# Altium schematic sheet Relay_circuit.SchDoc
size A4; SheetNumber: 3; SheetTotal: 6
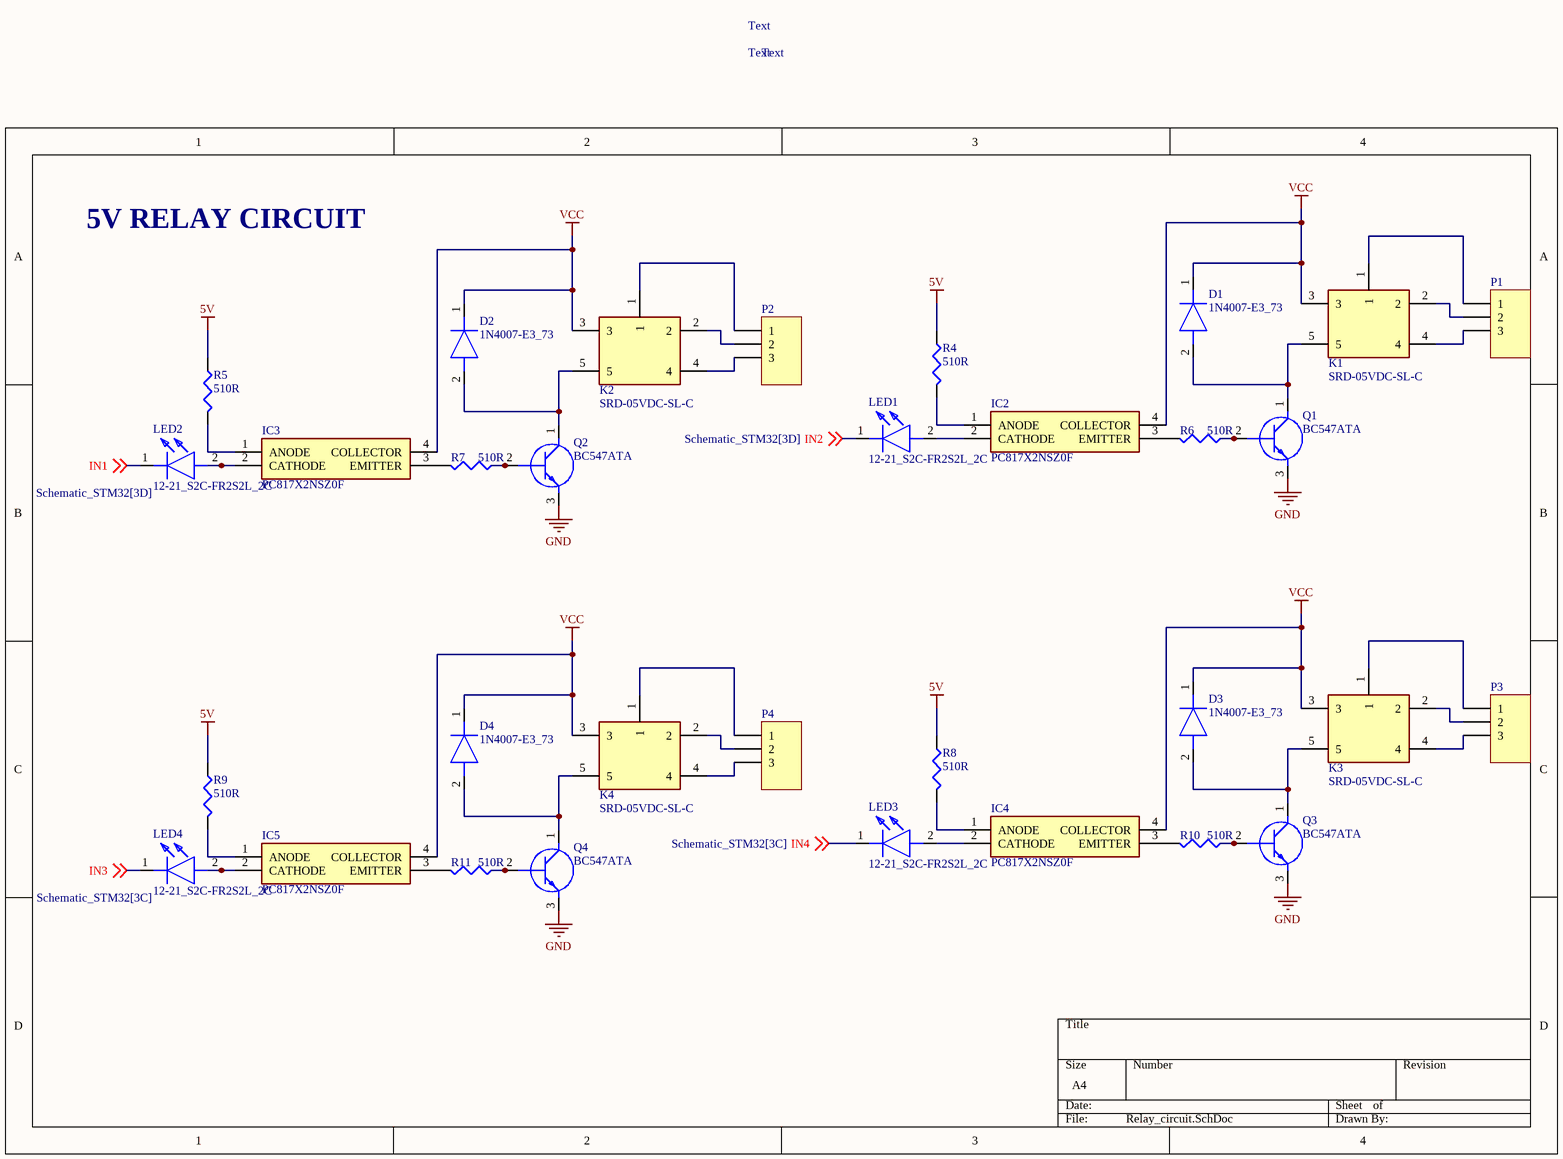
[diagram p0: Relay_circuit.SchDoc]

## Parts
D1  1N4007-E3_73  [DIOAD1405W86L465D235]
D2  1N4007-E3_73  [DIOAD1405W86L465D235]
D3  1N4007-E3_73  [DIOAD1405W86L465D235]
D4  1N4007-E3_73  [DIOAD1405W86L465D235]
IC2  PC817X2NSZ0F  [DIP762W60P254L458H400Q4N]
IC3  PC817X2NSZ0F  [DIP762W60P254L458H400Q4N]
IC4  PC817X2NSZ0F  [DIP762W60P254L458H400Q4N]
IC5  PC817X2NSZ0F  [DIP762W60P254L458H400Q4N]
K1  SRD-05VDC-SL-C  [SRD]
K2  SRD-05VDC-SL-C  [SRD]
K3  SRD-05VDC-SL-C  [SRD]
K4  SRD-05VDC-SL-C  [SRD]
LED1  12-21_S2C-FR2S2L_2C  [1221S2CFR2S2L2C]
LED2  12-21_S2C-FR2S2L_2C  [1221S2CFR2S2L2C]
LED3  12-21_S2C-FR2S2L_2C  [1221S2CFR2S2L2C]
LED4  12-21_S2C-FR2S2L_2C  [1221S2CFR2S2L2C]
P1  Header 3  [CON4PIN5MM]  (value not drawn)
P2  Header 3  [CON4PIN5MM]  (value not drawn)
P3  Header 3  [CON4PIN5MM]  (value not drawn)
P4  Header 3  [CON4PIN5MM]  (value not drawn)
Q1  BC547ATA  [TO-92_(TO-226)]
Q2  BC547ATA  [TO-92_(TO-226)]
Q3  BC547ATA  [TO-92_(TO-226)]
Q4  BC547ATA  [TO-92_(TO-226)]
R4  value 510R  [J1-0603]  (hidden comment: Res3)
R5  value 510R  [J1-0603]  (hidden comment: Res3)
R6  value 510R  [J1-0603]  (hidden comment: Res3)
R7  value 510R  [J1-0603]  (hidden comment: Res3)
R8  value 510R  [J1-0603]  (hidden comment: Res3)
R9  value 510R  [J1-0603]  (hidden comment: Res3)
R10  value 510R  [J1-0603]  (hidden comment: Res3)
R11  value 510R  [J1-0603]  (hidden comment: Res3)

## Nets
5V: R4.1 R5.1 R8.1 R9.1
GND: Q1.3(E) Q2.3(E) Q3.3(E) Q4.3(E)
VCC: D1.1(K) D2.1(K) D3.1(K) D4.1(K) IC2.4(COLLECTOR) IC3.4(COLLECTOR) IC4.4(COLLECTOR) IC5.4(COLLECTOR) K1.3 K2.3 K3.3 K4.3
IN1: LED2.1(K) ; off-sheet IN1
IN2: LED1.1(K) ; off-sheet IN2
IN3: LED4.1(K) ; off-sheet IN3
IN4: LED3.1(K) ; off-sheet IN4
NetD1_2: D1.2(A) K1.5 Q1.1(C)
NetD2_2: D2.2(A) K2.5 Q2.1(C)
NetD3_2: D3.2(A) K3.5 Q3.1(C)
NetD4_2: D4.2(A) K4.5 Q4.1(C)
NetIC2_1: IC2.1(ANODE) R4.2
NetIC2_2: IC2.2(CATHODE) LED1.2(A)
NetIC2_3: IC2.3(EMITTER) R6.2
NetIC3_1: IC3.1(ANODE) R5.2
NetIC3_2: IC3.2(CATHODE) LED2.2(A)
NetIC3_3: IC3.3(EMITTER) R7.2
NetIC4_1: IC4.1(ANODE) R8.2
NetIC4_2: IC4.2(CATHODE) LED3.2(A)
NetIC4_3: IC4.3(EMITTER) R10.2
NetIC5_1: IC5.1(ANODE) R9.2
NetIC5_2: IC5.2(CATHODE) LED4.2(A)
NetIC5_3: IC5.3(EMITTER) R11.2
NetK1_1: K1.1 P1.1
NetK1_2: K1.2 P1.2
NetK1_4: K1.4 P1.3
NetK2_1: K2.1 P2.1
NetK2_2: K2.2 P2.2
NetK2_4: K2.4 P2.3
NetK3_1: K3.1 P3.1
NetK3_2: K3.2 P3.2
NetK3_4: K3.4 P3.3
NetK4_1: K4.1 P4.1
NetK4_2: K4.2 P4.2
NetK4_4: K4.4 P4.3
NetQ1_2: Q1.2(B) R6.1
NetQ2_2: Q2.2(B) R7.1
NetQ3_2: Q3.2(B) R10.1
NetQ4_2: Q4.2(B) R11.1

Not connected (* = marked no-connect by the designer): P1 4; P2 4; P3 4; P4 4

## Notes on the sheet
- Text
- 5V RELAY CIRCUIT

## Library data of the parts
D1-D4 = 1N4007-E3_73: Diode; Manufacturer_Name: Vishay; Manufacturer_Part_Number: 1N4007-E3/73; Datasheet Link: https://mouser.componentsearchengine.com/Datasheets/2/1N4007-E3_73.pdf; Mouser Part Number: 625-1N4007-E3/73; Mouser Price/Stock: https://www.mouser.co.uk/ProductDetail/Vishay-General-Semiconductor/1N4007-E3-73?qs=N4vtoAxH%2FSqT3Ng3e4K0Gw%3D%3D; Arrow Part Number: 1N4007-E3/73; Arrow Price/Stock: https://www.arrow.com/en/products/1n4007-e373/vishay?region=europe
IC2-IC5 = PC817X2NSZ0F: Integrated Circuit; Manufacturer_Name: Sharp Microelectronics; Datasheet Link: https://datasheet.datasheetarchive.com/originals/distributors/Datasheets_SAMA/458e45842a103a05998fcebbd6f7366e.pdf; Height: 4mm; Manufacturer_Part_Number: PC817X2NSZ0F; Mouser Part Number: N/A; Mouser Price/Stock: https://www.mouser.co.uk/ProductDetail/Sharp-Microelectronics/PC817X2NSZ0F?qs=6kT3pPPHxnU7uYWM8Yy85A%3D%3D
K1-K4 = SRD-05VDC-SL-C: Relay or Contactor; Manufacturer_Name: Songle Relay; Datasheet Link: http://files.microjpm.webnode.com/200001010-dda41de9e1/Songle%20Relay%20Datasheet.pdf; Manufacturer_Part_Number: SRD-05VDC-SL-C
LED1-LED4 = 12-21_S2C-FR2S2L_2C: LED; Manufacturer_Name: Everlight; Manufacturer_Part_Number: 12-21/S2C-FR2S2L/2C; Datasheet Link: https://datasheet.lcsc.com/szlcsc/1901141904_Everlight-Elec-12-21-S2C-FR2S2L-2C_C183856.pdf; Height: 2.2mm
P1-P4 = Header 4: Header, 4-Pin; LatestRevisionDate: 17-Jul-2002; LatestRevisionNote: Re-released for DXP Platform.; Publisher: Altium Limited
Q1-Q4 = BC547ATA: Transistor BJT NPN; Manufacturer_Name: onsemi; Datasheet Link: https://www.onsemi.com/pub/Collateral/BC550-D.pdf; Manufacturer_Part_Number: BC547ATA; Mouser Part Number: 512-BC547ATA; Mouser Price/Stock: https://www.mouser.co.uk/ProductDetail/onsemi-Fairchild/BC547ATA?qs=ljbEvF4DwOMRdLfuzO8N4w%3D%3D; Arrow Part Number: BC547ATA; Arrow Price/Stock: https://www.arrow.com/en/products/bc547ata/on-semiconductor?region=europe
R4-R11 = Res3: Resistor; Published: 8-Jun-2000; LatestRevisionDate: 29-May-2009; LatestRevisionNote: IPC-7351 Footprint Added.; PackageReference: J1-0603; Publisher: Altium Limited; PackageDescription: Chip Resistor